# EAGLE design Mosfetyxbee (EAGLE 6.5.0)
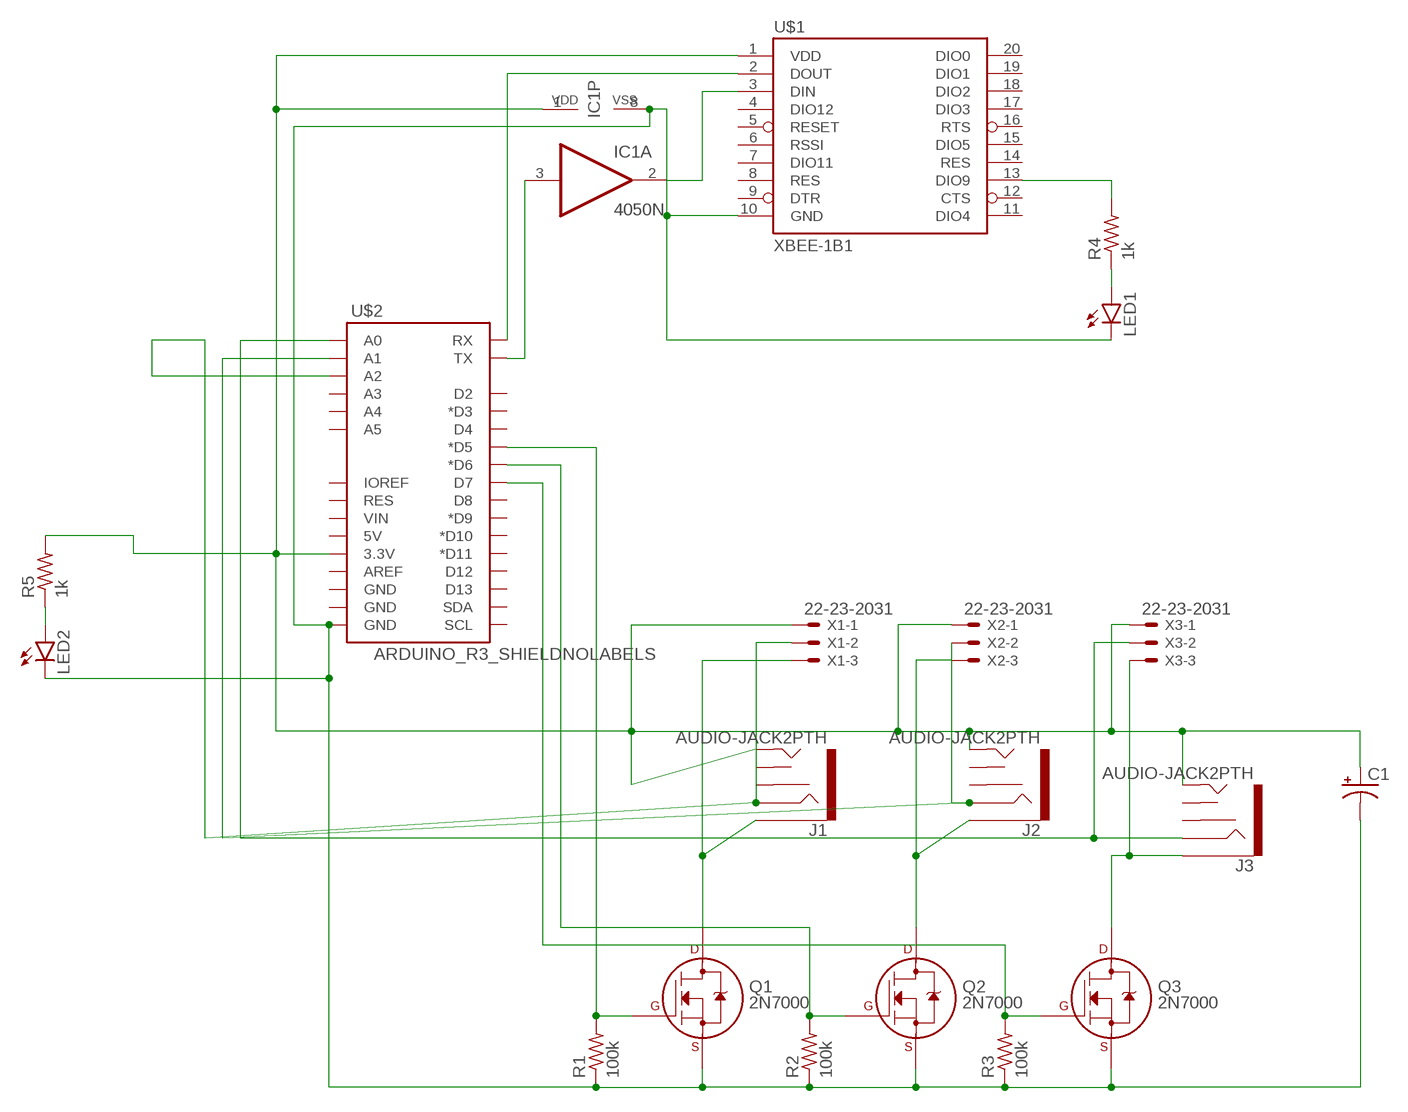
[diagram p0: schematic, sheet 1]

## Parts
C1  CAP_POLPTH2  [CPOL-RADIAL-10UF-25V]
IC1  4050N  [DIL16]
J1  AUDIO-JACK2PTH  [AUDIO-JACK]
J2  AUDIO-JACK2PTH  [AUDIO-JACK]
J3  AUDIO-JACK2PTH  [AUDIO-JACK]
LED1  LED3MM  [LED3MM]
LED2  LED3MM  [LED3MM]
Q1  2N7000  2N7000_TO92  [TO-92]
Q2  2N7000  2N7000_TO92  [TO-92]
Q3  2N7000  2N7000_TO92  [TO-92]
R1  100k  R-US_0207/12  [0207/12]
R2  100k  R-US_0207/12  [0207/12]
R3  100k  R-US_0207/12  [0207/12]
R4  1k  R-US_0207/10  [0207/10]
R5  1k  R-US_0207/10  [0207/10]
U$1  XBEE-1B1  [XBEE-1]
U$2  ARDUINO_R3_SHIELDNOLABELS  [UNO_R3_SHIELD_NOLABELS]
X1  22-23-2031  [22-23-2031]
X2  22-23-2031  [22-23-2031]
X3  22-23-2031  [22-23-2031]

## Nets
N$1: Q1.2(G) R1.2 U$2.D5(*D5)
N$2: Q2.2(G) R2.2 U$2.D6(*D6)
N$3: Q3.2(G) R3.2 U$2.D7
N$4: J1.SLEEVE Q1.3(D) X1.3
N$5: J2.SLEEVE Q2.3(D) X2.3
N$6: J3.SLEEVE Q3.3(D) X3.3
N$7: C1.1(+) IC1.1(P:VDD) J1.TIP J2.TIP J3.TIP R5.2 U$1.1(VDD) U$2.3.3V X1.1 X2.1 X3.1
N$8: C1.2(-) IC1.8(P:VSS) LED1.K(C) LED2.K(C) Q1.1(S) Q2.1(S) Q3.1(S) R1.1 R2.1 R3.1 U$1.10(GND) U$2.GND@0(GND)
N$13: J1.RING U$2.A2 X1.2
N$14: J2.RING U$2.A1 X2.2
N$15: J3.RING U$2.A0 X3.2
N$16: IC1.3(A:I) U$2.TX
N$17: IC1.2(A:O) U$1.3(DIN)
N$18: U$1.2(DOUT) U$2.RX
N$23: R4.2 U$1.13(DIO9)
N$24: LED1.A R4.1
N$25: LED2.A R5.1
Unconnected: IC1.4(B:O) IC1.5(B:I) IC1.6(C:O) IC1.7(C:I) IC1.9(D:I) IC1.10(D:O) IC1.11(E:I) IC1.12(E:O) IC1.14(F:I) IC1.15(F:O) J1.RSH J1.TSH J2.RSH J2.TSH J3.RSH J3.TSH U$1.4(DIO12) U$1.5(RESET) U$1.6(RSSI) U$1.7(DIO11) U$1.8(RES) U$1.9(DTR) U$1.11(DIO4) U$1.12(CTS) U$1.14(RES) U$1.15(DIO5) U$1.16(RTS) U$1.17(DIO3) U$1.18(DIO2) U$1.19(DIO1) U$1.20(DIO0) U$2.5V U$2.A3 U$2.A4 U$2.A5 U$2.AREF U$2.D2 U$2.D3(*D3) U$2.D4 U$2.D8 U$2.D9(*D9) U$2.D10(*D10) U$2.D11(*D11) U$2.D12 U$2.D13 U$2.GND@1(GND) U$2.GND@2(GND) U$2.IOREF U$2.RES U$2.SCL U$2.SDA U$2.VIN

## Library data of the parts
C1 = SparkFun-Capacitors:CAP_POL: Capacitor Polarized These are standard SMD and PTH capacitors. Normally 10uF, 47uF, and 100uF in electrolytic and tantalum varieties. Always verify the external diameter of the through hole cap, it varies with capacity, voltage, and manufacturer. The EIA devices should be standard.
IC1 = 40xx:4050: Hex non-inverting BUFFER
J1-J3 = SparkFun-Connectors:AUDIO-JACK2: Stereo audio jack with bypass switches. SMT version used on LilyPad MP3 board.; PROD_ID: CONN-08774
LED1 LED2 = SparkFun-LED:LED: LEDs Standard schematic elements and footprints for 5mm, 3mm, 1206, and 0603 sized LEDs. 5mm - Spark Fun Electronics SKU : COM-00529 (and others)
Q1-Q3 = transistors:2N700*: 2N7000, 2N7002, NDS7002A N-channel enhancement mode MOSFET
R1-R5 = resistor:R-US_: RESISTOR, American symbol
U$1 = SparkFun-RF:XBEE-1: Xbee module footprints SMT header is CONN-09042.
U$2 = SparkFun-Boards:ARDUINO_R3_SHIELD: Shield form compatible with the Arduino Uno R3.
X1-X3 = con-molex:22-23-2031: .100" (2.54mm) Center Header - 3 Pin; MF: MOLEX; MPN: 22-23-2031; OC_FARNELL: 1462950; OC_NEWARK: 30C0862

## Board
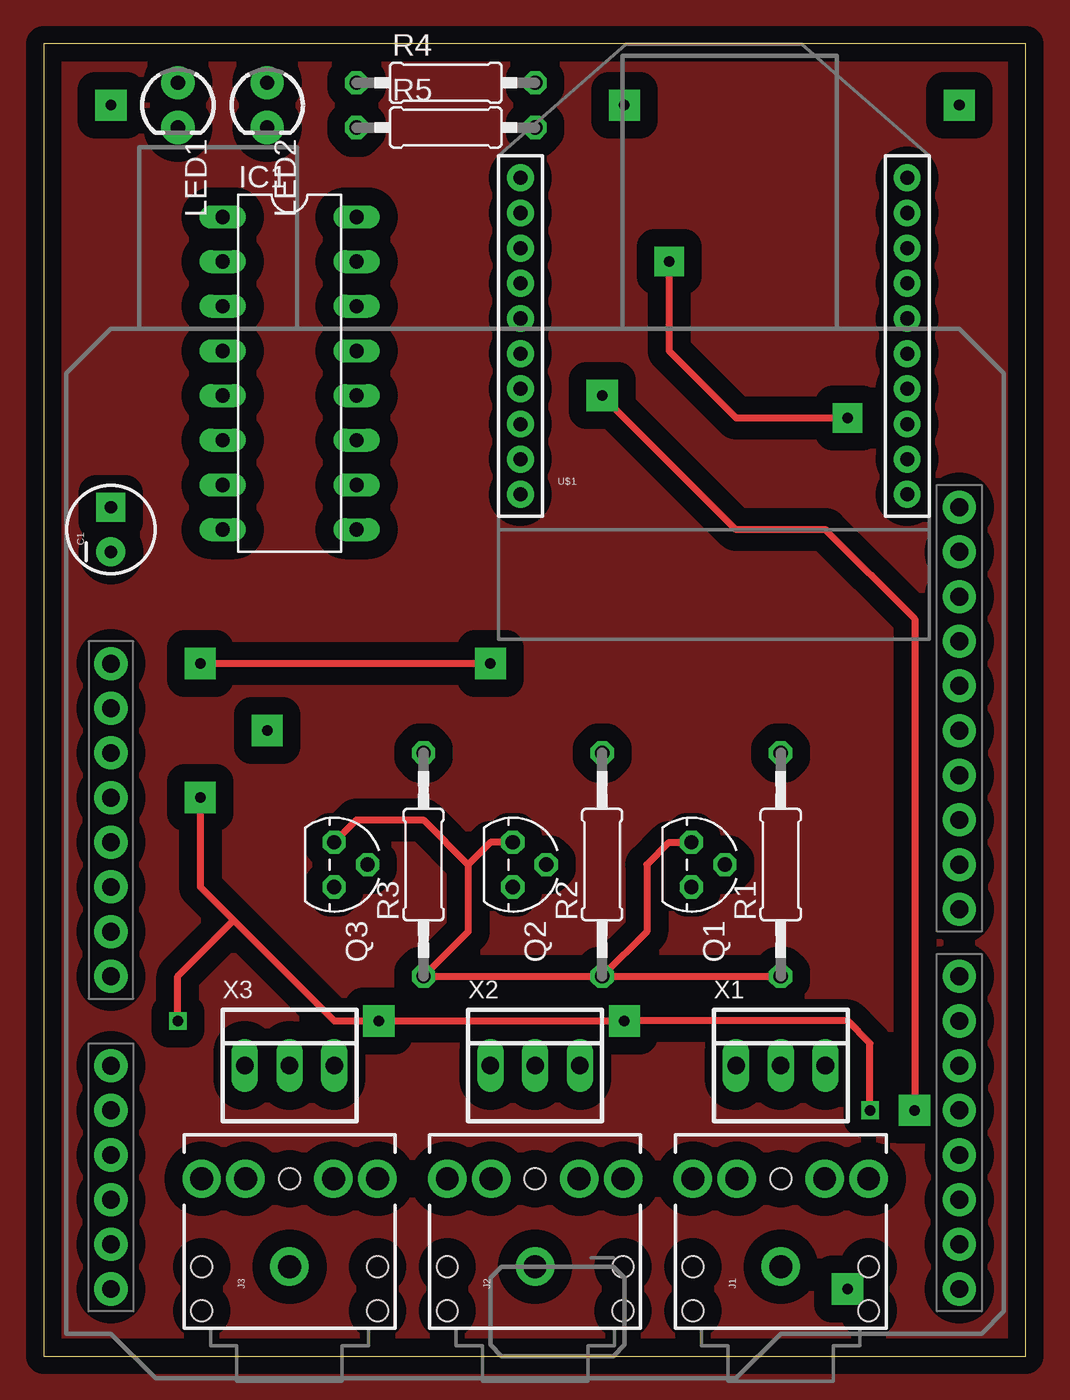
[diagram p1: board, top side]
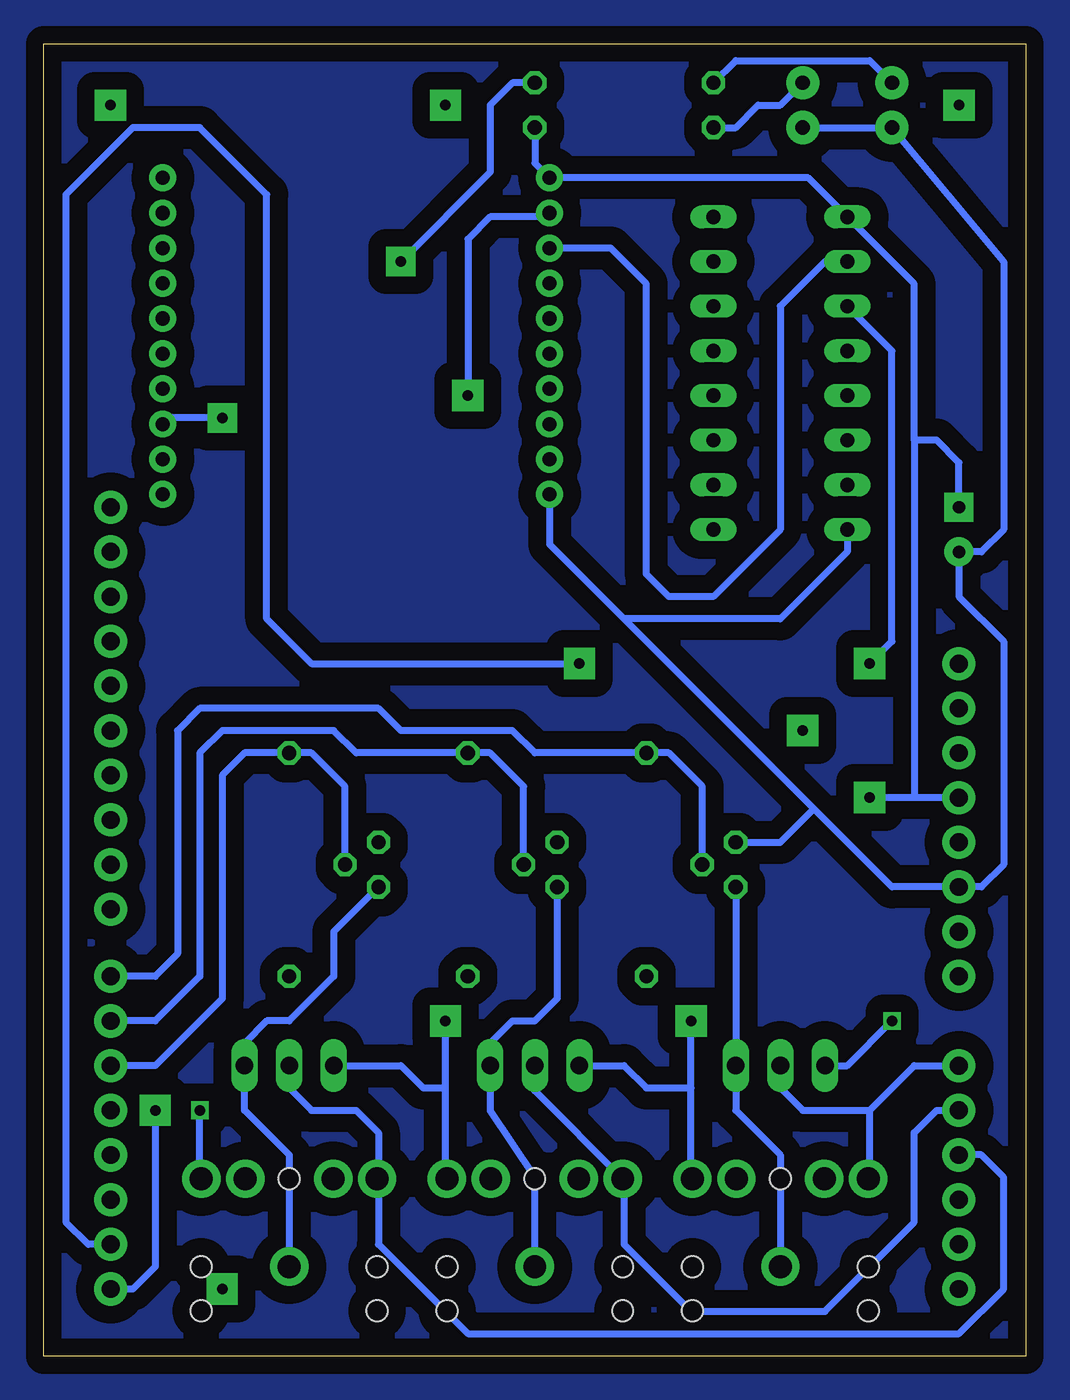
[diagram p2: board, bottom side, seen from below]

Size 55.86 x 74.6 mm. Coordinates in mm from the lower left corner, seen from the top.
Outline: 0,0 55.86,0 55.86,74.6 0,74.6 0,0
Copper layers (1*16): Top 0.035mm / dielectric 1.5mm / Bottom 0.035mm
Design rules "default": minimum track width 10mil, minimum drill 24mil, track to track 8mil, track to pad 8mil, pad to pad 8mil, via to via 8mil, smd to smd 8mil, copper to edge 40mil, drill to drill 8mil, minimum pad ring 10mil, minimum via ring 8mil, stop-mask expansion 4mil, vias tented up to drill 0mil, thermal gap 10mil

### Footprints (pad centres in the part's own frame; a part is rotated, then mirrored left to right if it is on the bottom)
CPOL-RADIAL-10UF-25V = drill 0.7 pad 1.651 square: 1 1.27,0 | drill 0.7 pad 1.651: 2 -1.27,0
DIL16 = drill 0.813 long: 1 -8.89,-3.81; 2 -6.35,-3.81; 3 -3.81,-3.81; 4 -1.27,-3.81; 5 1.27,-3.81; 6 3.81,-3.81; 7 6.35,-3.81; 8 8.89,-3.81; 9 8.89,3.81; 10 6.35,3.81; 11 3.81,3.81; 12 1.27,3.81; 13 -1.27,3.81; 14 -3.81,3.81; 15 -6.35,3.81; 16 -8.89,3.81
AUDIO-JACK = drill 1.3 pad 2.184: RING 5,5; RSH 5,2.5; SLEEVE 0,0; TIP 5,-5; TSH 5,-2.5 | hole 1.2: 0,5; -2.5,5; -2.5,-5; 0,-5; 5,0
LED3MM = drill 0.813 pad 1.88: A -1.27,0; K 1.27,0
TO-92 = drill 0.813 octagon: 1 -1.27,0; 2 0,1.905; 3 1.27,0
0207/12 = drill 0.813 octagon: 1 -6.35,0; 2 6.35,0
0207/10 = drill 0.813 octagon: 1 -5.08,0; 2 5.08,0
XBEE-1 = drill 0.8 pad 1.524: 1 -11,20; 2 -11,18; 3 -11,16; 4 -11,14; 5 -11,12; 6 -11,10; 7 -11,8; 8 -11,6; 9 -11,4; 10 -11,2; 11 11,2; 12 11,4; 13 11,6; 14 11,8; 15 11,10; 16 11,12; 17 11,14; 18 11,16; 19 11,18; 20 11,20
UNO_R3_SHIELD_NOLABELS = drill 1.016 pad 1.88: 3.3V 50.8,26.67; 5V 50.8,29.21; A0 50.8,41.91; A1 50.8,44.45; A2 50.8,46.99; A3 50.8,49.53; A4 50.8,52.07; A5 50.8,54.61; AREF 2.54,15.24; D2 2.54,49.53; D3 2.54,46.99; D4 2.54,44.45; D5 2.54,41.91; D6 2.54,39.37; D7 2.54,36.83; D8 2.54,33.02; D9 2.54,30.48; D10 2.54,27.94; D11 2.54,25.4; D12 2.54,22.86; D13 2.54,20.32; GND@0 50.8,31.75; GND@1 50.8,34.29; GND@2 2.54,17.78; IOREF 50.8,21.59; NC 50.8,19.05; RES 50.8,24.13; RX 2.54,54.61; SCL 2.54,10.16; SDA 2.54,12.7; TX 2.54,52.07; VIN 50.8,36.83
22-23-2031 = drill 1 long: 1 -2.54,0; 2 0,0; 3 2.54,0

### Placement (x,y rotation side)
C1  3.81,46.99 90 top
IC1  13.97,55.88 270 top
J1  41.91,5.08 90 top
J2  27.94,5.08 90 top
J3  13.97,5.08 90 top
LED1  7.62,71.12 270 top
LED2  12.7,71.12 270 top
Q1  36.83,27.94 270 top
Q2  26.67,27.94 270 top
Q3  16.51,27.94 270 top
R1  41.91,27.94 90 top
R2  31.75,27.94 90 top
R3  21.59,27.94 90 top
R4  22.86,72.39 0 top
R5  22.86,69.85 0 top
U$1  38.1,46.99 0 top
U$2  54.61,58.42 180 top
X1  41.91,16.51 0 top
X2  27.94,16.51 0 top
X3  13.97,16.51 0 top

### Tracks (layer width: path | path; a pad name or v marks a point on that pad's centre or on a via)
N$1
  Bottom 0.406: Q1.2 38.73,32.39 40.64,34.29 R1.2 44.45,34.29 45.72,33.02 45.72,20.32 49.53,16.51 U$2.D5
N$2
  Bottom 0.406: Q2.2 28.58,32.39 30.48,34.29 R2.2 38.1,34.29 39.37,35.56 45.72,35.56 46.99,34.29 46.99,21.59 49.53,19.05 U$2.D6
N$3
  Bottom 0.406: Q3.2 18.42,32.39 20.32,34.29 R3.2 27.94,34.29 29.21,35.56 35.56,35.56 36.83,36.83 46.99,36.83 48.26,35.56 48.26,22.86 49.53,21.59 U$2.D7
N$4
  Bottom 0.406: Q1.3 39.37,24.13 39.37,21.59 41.91,19.05 43.18,19.05 44.45,17.78 X1.3 44.45,13.97 41.91,11.43 J1.SLEEVE
N$5
  Bottom 0.406: Q2.3 26.67,20.32 27.94,19.05 29.21,19.05 30.48,17.78 X2.3 30.48,13.97 27.94,10.16 J2.SLEEVE
N$6
  Bottom 0.406: Q3.3 X3.3 16.51,15.24 16.51,13.97 13.97,11.43 J3.SLEEVE
N$7  (via drill 0.6, 0.6 pad 1.78)
  Top 0.406: v8.89,31.75 8.89,26.67 10.8,24.77 | 10.8,24.77 16.51,19.05 v19.05,19.05 v33.02,19.05 45.72,19.05 46.99,17.78 v46.99,13.97 | v7.62,19.05 7.62,21.59 10.8,24.77
  Bottom 0.406: U$2.3.3V 6.35,31.75 | 6.35,31.75 v8.89,31.75 | 6.35,52.07 6.35,31.75 | J3.TIP 19.05,10.16 19.05,15.24 | 19.05,15.24 v19.05,19.05 | J2.TIP 33.02,10.16 33.02,15.24 | 33.02,15.24 v33.02,19.05 | C1.1 3.81,50.8 5.08,52.07 6.35,52.07 | 6.35,52.07 6.35,60.96 IC1.1 12.38,66.99 U$1.1 27.94,67.83 R5.2 | X2.1 22.86,16.51 21.59,15.24 19.05,15.24 | J1.TIP 46.99,10.08 v46.99,13.97 | X1.1 35.56,16.51 34.29,15.24 33.02,15.24 | X3.1 10.16,16.51 v7.62,19.05
N$8
  Top 0.406: Q2.1 25.4,29.21 24.13,27.94 | 24.13,27.94 24.13,24.13 R3.1 R2.1 | R2.1 34.29,24.13 34.29,27.94 35.56,29.21 Q1.1 | R2.1 R1.1 | Q3.1 17.78,30.48 21.59,30.48 24.13,27.94
  Bottom 0.406: U$1.10 27.1,46.15 22.86,41.91 | 22.86,41.91 12.06,31.11 | 12.06,31.11 7.62,26.67 U$2.GND@0 2.54,26.67 1.27,27.94 1.27,40.64 3.81,43.18 C1.2 2.54,45.72 1.27,46.99 1.27,62.23 LED1.K LED2.K | Q3.1 13.97,29.21 12.06,31.11 | IC1.8 10.16,45.72 13.97,41.91 22.86,41.91
N$9  (via drill 0.6 pad 1.78)
  other vias: 3.81,71.12
N$10  (via drill 0.6 pad 1.78)
  other vias: 33.02,71.12
N$11  (via drill 0.6 pad 1.78)
  other vias: 52.07,71.12
N$13
  Bottom 0.406: U$2.A2 2.54,11.43 1.27,10.16 1.27,3.81 3.81,1.27 31.75,1.27 36.83,6.35 36.83,10 J1.RING 36.83,10.16 36.83,12.7 38.1,13.97 40.64,13.97 41.91,15.24 X1.2
N$14
  Bottom 0.406: U$2.A1 5.08,13.97 6.35,12.7 6.35,7.62 11.43,2.54 19.05,2.54 22.86,6.35 22.86,10 J2.RING 27.94,15.08 X2.2
N$15
  Bottom 0.406: J3.RING 8.89,10.16 8.89,13.97 | 8.89,13.97 6.35,16.51 U$2.A0 | X3.2 13.97,15.24 12.7,13.97 8.89,13.97
N$16  (via drill 0.6 pad 1.78)
  Top 0.406: v25.4,39.37 v8.89,39.37
  Bottom 0.406: U$2.TX 53.34,6.35 54.61,7.62 54.61,66.04 50.8,69.85 46.99,69.85 43.18,66.04 43.18,41.91 40.64,39.37 v25.4,39.37 | v8.89,39.37 7.62,40.64 7.62,57.15 IC1.3
N$17
  Bottom 0.406: IC1.2 11.43,62.23 13.97,59.69 13.97,46.99 17.78,43.18 20.32,43.18 21.59,44.45 21.59,60.96 23.62,62.99 U$1.3
N$18  (via drill 0.6 pad 1.78)
  Top 0.406: v49.53,13.97 49.53,41.91 44.45,46.99 39.37,46.99 v31.75,54.61
  Bottom 0.406: v49.53,13.97 49.53,5.08 50.8,3.81 U$2.RX | U$1.2 27.32,64.77 30.48,64.77 31.75,63.5 v31.75,54.61
N$19  (via drill 0.6 pad 1.78)
  other vias: 45.72,3.81
N$20  (via drill 0.6 pad 1.78)
  other vias: 12.7,35.56
N$21
  pour Bottom (isolate 1.016): 0,74.93 55.88,74.93 55.88,0 0,0
N$22
  pour Top (isolate 1.016): 0,74.93 55.88,74.93 55.88,0 0,0
N$23  (via drill 0.6 pad 1.68)
  Top 0.406: v35.56,62.23 35.56,57.15 39.37,53.34 v45.72,53.34
  Bottom 0.406: R4.2 29.21,72.39 30.48,71.12 30.48,67.31 v35.56,62.23 | v45.72,53.34 48.75,53.34 U$1.13
N$24
  Bottom 0.406: R4.1 16.51,73.66 8.89,73.66 LED1.A
N$25
  Bottom 0.406: R5.1 16.51,69.85 15.24,71.12 13.97,71.12 LED2.A
N$26
  pour Bottom: 25.4,82.55 19.05,86.36 25.4,86.36
  pour Bottom: -11.43,40.64 -15.24,40.64 -15.24,46.99
  pour Bottom: 67.31,40.64 71.12,46.99 71.12,40.64
N$27
  pour Top: -15.24,46.99 -15.24,40.64 -11.43,40.64
  pour Top: 29.21,-8.89 29.21,-12.7 35.56,-12.7
  pour Top: 71.12,30.48 71.12,36.83 67.31,36.83
  pour Top: 25.4,82.55 25.4,86.36 19.05,86.36
N$28
  pour Top: -17.78,46.99 -15.24,46.99 -15.24,40.64 -11.43,40.64 -11.43,39.37 0,39.37 0,74.93 55.88,74.93 55.88,38.1 67.31,38.1 67.31,40.64 71.12,40.64 71.12,46.99 73.66,46.99 73.66,88.9 35.56,88.9 35.56,86.36 29.21,86.36 29.21,82.55 25.4,82.55 25.4,86.36 19.05,86.36 19.05,88.9 -17.78,88.9
  pour Bottom: -17.78,46.99 -15.24,46.99 -15.24,40.64 -11.43,40.64 -11.43,39.37 0,39.37 0,74.93 55.88,74.93 55.88,38.1 67.31,38.1 67.31,40.64 71.12,40.64 71.12,46.99 73.66,46.99 73.66,88.9 35.56,88.9 35.56,86.36 29.21,86.36 29.21,82.55 25.4,82.55 25.4,86.36 19.05,86.36 19.05,88.9 -17.78,88.9
N$29
  pour Top: -11.43,39.37 0,39.37 0,0 55.88,0 55.88,38.1 67.31,38.1 67.31,36.83 71.12,36.83 71.12,30.48 73.66,30.48 73.66,-15.24 35.56,-15.24 35.56,-12.7 29.21,-12.7 29.21,-8.89 25.4,-8.89 25.4,-12.7 19.05,-12.7 19.05,-15.24 -17.78,-15.24 -17.78,30.48 -15.24,30.48 -15.24,36.83 -11.43,36.83
  pour Bottom: -11.43,39.37 0,39.37 0,0 55.88,0 55.88,38.1 67.31,38.1 67.31,36.83 71.12,36.83 71.12,30.48 73.66,30.48 73.66,-15.24 35.56,-15.24 35.56,-12.7 29.21,-12.7 29.21,-8.89 25.4,-8.89 25.4,-12.7 19.05,-12.7 19.05,-15.24 -17.78,-15.24 -17.78,30.48 -15.24,30.48 -15.24,36.83 -11.43,36.83